# Altium schematic sheet PassiveFilter.SchDoc
size A
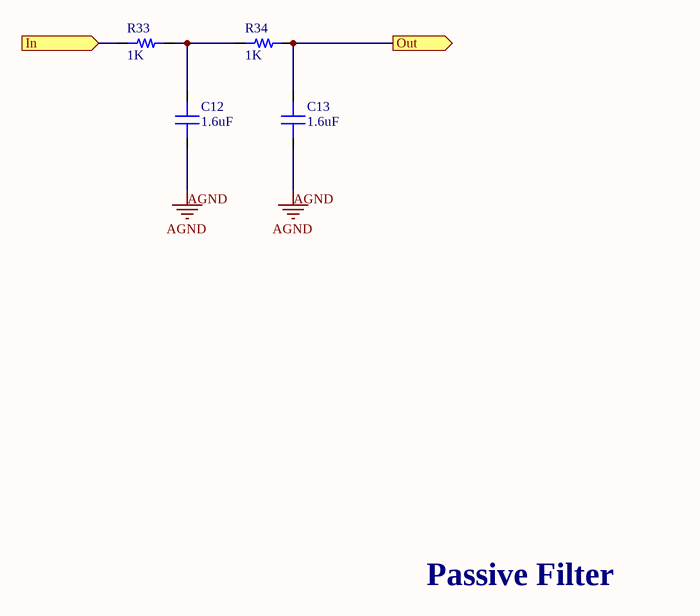
[diagram p0: PassiveFilter.SchDoc]

## Parts
C12  capacitance: 1.6uF  [0603]  (hidden comment: capacitor)
C13  capacitance: 1.6uF  [0603]  (hidden comment: capacitor)
R33  resistance: 1K  [0603]  (hidden comment: resistor)
R34  resistance: 1K  [0603]  (hidden comment: resistor)

## Ports
In (in), Out (out)

## Nets
AGND: C12.1 C13.1
In: R33.1 ; port In
Out: C13.2 R34.2 ; port Out
NetC12_2: C12.2 R33.2 R34.1

## Notes on the sheet
- Passive Filter

## Library data of the parts
C12 C13 = 1: Generic 0603 capacitor; id: 1; voltage: 50; dielectric: Ceramic; percent tolerance: 10; name: 0603 Capacitor; ESR: 1; package: 0603; quantity: 0
R33 R34 = 1: id: 1; name: 0603 Resistor; percent tolerance: 5; package: 0603; quantity: 0